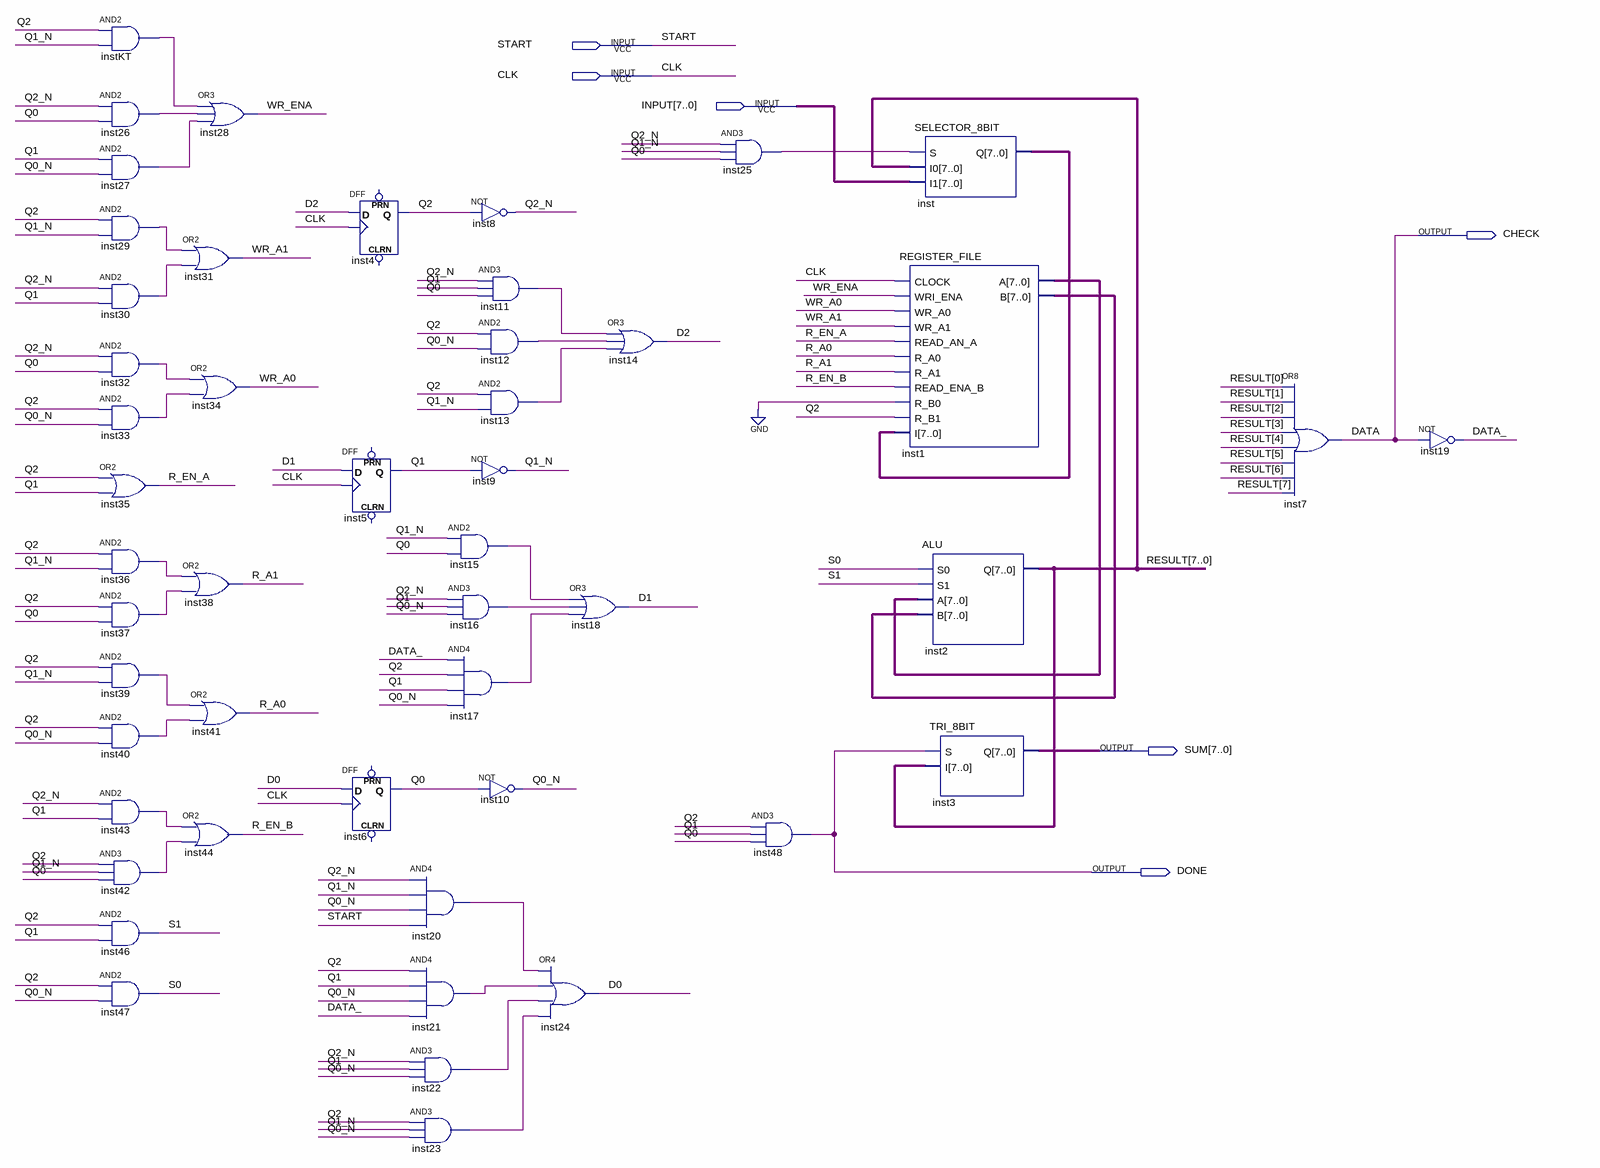
[diagram p0: schematic sheet]
// Quartus schematic SUM_CIRCUIT.bdf as structural Verilog: 49 symbols, 6 pins
module SUM_CIRCUIT (
  input  START,
  input  CLK,
  input  [7:0] INPUT,
  output CHECK,
  output [7:0] SUM,
  output DONE
);

  wire D0, D1, D2, DATA_, inst11_out, inst12_out, inst13_out, inst15_out, inst16_out, inst17_out, inst20_out,
       inst21_out, inst22_out, inst23_out, inst25_out, inst26_out, inst27_out, inst29_out, inst30_out,
       inst32_out, inst33_out, inst36_out, inst37_out, inst39_out, inst40_out, inst42_out, inst43_out,
       instKT_out, Q0, Q0_N, Q1, Q1_N, Q2, Q2_N, R_A0, R_A1, R_EN_A, R_EN_B, S0, S1, WR_A0, WR_A1, WR_ENA;
  wire [7:0] inst1_a, inst1_b, inst_q, RESULT;

  and instKT (instKT_out, Q2, Q1_N);
  and inst26 (inst26_out, Q2_N, Q0);
  and inst27 (inst27_out, Q1, Q0_N);
  and inst29 (inst29_out, Q2, Q1_N);
  and inst30 (inst30_out, Q2_N, Q1);
  and inst32 (inst32_out, Q2_N, Q0);
  and inst33 (inst33_out, Q2, Q0_N);
  or inst35 (R_EN_A, Q2, Q1);
  and inst36 (inst36_out, Q2, Q1_N);
  and inst37 (inst37_out, Q2, Q0);
  and inst39 (inst39_out, Q2, Q1_N);
  and inst40 (inst40_out, Q2, Q0_N);
  and inst43 (inst43_out, Q2_N, Q1);
  and inst42 (inst42_out, Q2, Q1_N, Q0);
  and inst46 (S1, Q2, Q1);
  and inst47 (S0, Q2, Q0_N);
  or inst28 (WR_ENA, instKT_out, inst26_out, inst27_out);
  or inst31 (WR_A1, inst29_out, inst30_out);
  or inst34 (WR_A0, inst32_out, inst33_out);
  or inst38 (R_A1, inst36_out, inst37_out);
  or inst41 (R_A0, inst39_out, inst40_out);
  or inst44 (R_EN_B, inst43_out, inst42_out);
  DFF inst4 (.CLK(CLK), .D(D2), .Q(Q2));  // open: CLRN, PRN
  DFF inst5 (.CLK(CLK), .D(D1), .Q(Q1));  // open: CLRN, PRN
  DFF inst6 (.CLK(CLK), .D(D0), .Q(Q0));  // open: CLRN, PRN
  and inst20 (inst20_out, Q2_N, Q1_N, Q0_N, START);
  and inst21 (inst21_out, Q2, Q1, Q0_N, DATA_);
  and inst22 (inst22_out, Q2_N, Q1, Q0_N);
  and inst23 (inst23_out, Q2, Q1_N, Q0_N);
  not inst8 (Q2_N, Q2);
  not inst9 (Q1_N, Q1);
  and inst15 (inst15_out, Q1_N, Q0);
  and inst16 (inst16_out, Q2_N, Q1, Q0_N);
  and inst17 (inst17_out, DATA_, Q2, Q1, Q0_N);
  and inst11 (inst11_out, Q2_N, Q1, Q0);
  and inst12 (inst12_out, Q2, Q0_N);
  and inst13 (inst13_out, Q2, Q1_N);
  not inst10 (Q0_N, Q0);
  or inst18 (D1, inst15_out, inst16_out, inst17_out);
  or inst24 (D0, inst20_out, inst21_out, inst22_out, inst23_out);
  or inst14 (D2, inst11_out, inst12_out, inst13_out);
  and inst25 (inst25_out, Q2_N, Q1_N, Q0);
  and inst48 (DONE, Q2, Q1, Q0);
  REGISTER_FILE inst1 (
    .CLOCK(CLK), .WRI_ENA(WR_ENA), .WR_A0(WR_A0), .WR_A1(WR_A1), .READ_AN_A(R_EN_A), .R_A0(R_A0),
    .R_A1(R_A1), .READ_ENA_B(R_EN_B), .R_B0(1'b0), .R_B1(Q2), .I(inst_q), .A(inst1_a), .B(inst1_b));
  SELECTOR_8BIT inst (.S(inst25_out), .I0(RESULT), .I1(INPUT), .Q(inst_q));
  ALU inst2 (.S0(S0), .S1(S1), .A(inst1_a), .B(inst1_b), .Q(RESULT));
  TRI_8BIT inst3 (.S(DONE), .I(RESULT), .Q(SUM));
  or inst7 (CHECK, RESULT[0], RESULT[1], RESULT[2], RESULT[3], RESULT[4], RESULT[5], RESULT[6], RESULT[7]);
  not inst19 (DATA_, CHECK);

  // Other names for the same wires on the sheet: DATA = CHECK
endmodule
